# Altium schematic sheet MPCIE.SchDoc
size A3; SheetNumber: 10; SheetTotal: 22
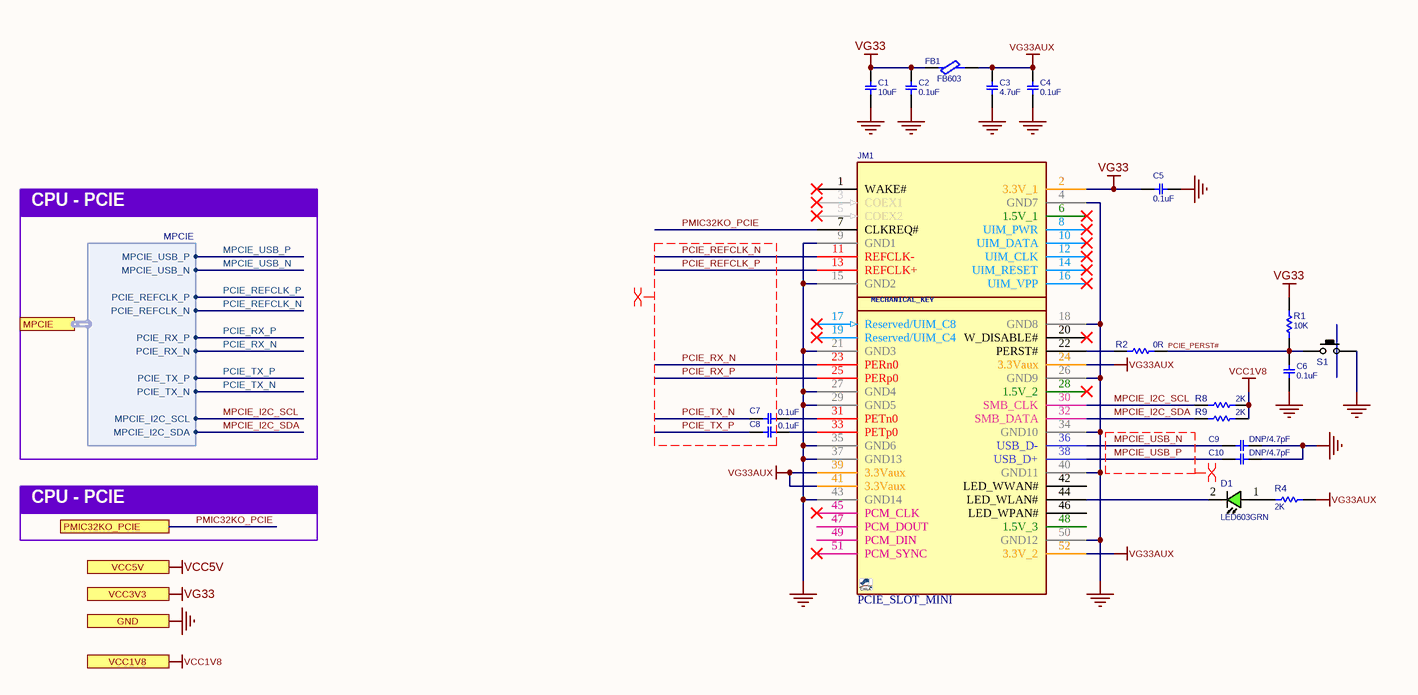
[diagram p0: MPCIE.SchDoc]

## Parts
C1  10uF  [C0402]
C2  0.1uF  [C0402]
C3  4.7uF  [C0402]
C4  0.1uF  [C0402]
C5  0.1uF  [C0402]
C6  0.1uF  [C0402]
C7  0.1uF  [C0402]
C8  0.1uF  [C0402]
C9  DNP/4.7pF  [C0402]
C10  DNP/4.7pF  [C0402]
D1  LED603GRN  [LED0603GRN]
FB1  FB603  [L0603]
JM1  PCIE_SLOT_MINI  [PCIE_MIN_CARD_FULL]
R1  10K  [R0402]
R2  0R  [R0402]
R4  2K  [R0402]
R8  2K  [R0402]
R9  2K  [R0402]
S1  PUSHBUTTON  [SWPBS_SPST_3X2X1]  (value not drawn)

## Ports
GND, MPCIE (harness MPCIE), PMIC32KO_PCIE, VCC1V8, VCC3V3, VCC5V

## Harnesses
MPCIE: PCIE_REFCLK_P, PCIE_REFCLK_N, MPCIE_USB_P, MPCIE_USB_N, PCIE_RX_P, PCIE_RX_N, PCIE_TX_P, PCIE_TX_N, MPCIE_I2C_SCL, MPCIE_I2C_SDA

## Nets
GND: C1.2 C2.2 C3.1 C4.2 C5.2 C6.1 C9.1 C10.1 JM1.4(GND7) JM1.9(GND1) JM1.15(GND2) JM1.18(GND8) JM1.21(GND3) JM1.26(GND9) JM1.27(GND4) JM1.29(GND5) JM1.34(GND10) JM1.35(GND6) JM1.37(GND13) JM1.40(GND11) JM1.43(GND14) JM1.50(GND12) S1.2(P3) ; port GND
VCC1V8: R8.2 R9.2 ; port VCC1V8
VCC5V: port VCC5V
VG33: C1.1 C2.1 C5.1 FB1.1 JM1.2(3.3V_1) R1.1 ; port VCC3V3
VG33AUX: C3.2 C4.1 FB1.2 JM1.24(3.3Vaux) JM1.39(3.3Vaux) JM1.41(3.3Vaux) JM1.52(3.3V_2) R4.2
MPCIE_I2C_SCL: JM1.30(SMB_CLK) R8.1 ; port MPCIE.MPCIE_I2C_SCL
MPCIE_I2C_SDA: JM1.32(SMB_DATA) R9.1 ; port MPCIE.MPCIE_I2C_SDA
MPCIE_USB_N: C9.2 JM1.36(USB_D-) ; port MPCIE.MPCIE_USB_N
MPCIE_USB_P: C10.2 JM1.38(USB_D+) ; port MPCIE.MPCIE_USB_P
PCIE_PERST#: C6.2 R1.2 R2.2 S1.1(P1)
PCIE_REFCLK_N: JM1.11(REFCLK-) ; port MPCIE.PCIE_REFCLK_N
PCIE_REFCLK_P: JM1.13(REFCLK+) ; port MPCIE.PCIE_REFCLK_P
PCIE_RX_N: JM1.23(PERn0) ; port MPCIE.PCIE_RX_N
PCIE_RX_P: JM1.25(PERp0) ; port MPCIE.PCIE_RX_P
PCIE_TX_N: C7.2 ; port MPCIE.PCIE_TX_N
PCIE_TX_P: C8.2 ; port MPCIE.PCIE_TX_P
PMIC32KO_PCIE: JM1.7(CLKREQ#) ; port PMIC32KO_PCIE
NetC7_1: C7.1 JM1.31(PETn0)
NetC8_1: C8.1 JM1.33(PETp0)
NetD1_1: D1.1(ANODE) R4.1
NetD1_2: D1.2(CATHODE) JM1.44(LED_WLAN#)
NetJM1_22: JM1.22(PERST#) R2.1

Not connected (* = marked no-connect by the designer): JM1 1(WAKE#)* 3(COEX1)* 5(COEX2)* 6(1.5V_1)* 8(UIM_PWR)* 10(UIM_DATA)* 12(UIM_CLK)* 14(UIM_RESET)* 16(UIM_VPP)* 17(Reserved/UIM_C8)* 19(Reserved/UIM_C4)* 20(W_DISABLE#)* 28(1.5V_2)* 42(LED_WWAN#) 45(PCM_CLK)* 46(LED_WPAN#) 47(PCM_DOUT) 48(1.5V_3) 49(PCM_DIN) 51(PCM_SYNC)*

## Layout directives
differential pair: MPCIE_USB_N, MPCIE_USB_P, PCIE_REFCLK_N, PCIE_REFCLK_P, PCIE_RX_N, PCIE_RX_P, PCIE_TX_N, PCIE_TX_P

## Notes on the sheet
- CPU - PCIE
- (in symbol PCIE_SLOT_MINI) MECHANICAL_KEY

## Library data of the parts
C1 = CAP_SMD_MLCC: CAP, MLCC; PARAM: X5R, 20%; MANF_P#: CL05A106MP5NUNC; MANF: Samsung; PARAM2: 10v; PRICE: 10,000: $0.034; ASSEMBLY: ASSEMBLY; VALUE: 10uF
C2 C4-C8 = CAP_SMD_MLCC_100n50TDK: CAP, MLCC; PARAM: X5R, 10%; MANF_P#: GRM155R61E104; MANF: Murata; PARAM2: 25v; ASSEMBLY: ASSEMBLY; PRICE: 10,000:$0.006; VALUE: 0.1uF
C3 = CAP_SMD_MLCC: CAP, MLCC; PARAM: X5R, 20%; MANF_P#: CL05A475MP5NRNC; MANF: Samsung; PARAM2: 10v; PRICE: 10,000: $0.034; ASSEMBLY: ASSEMBLY; VALUE: 4.7uF
C9 C10 = CAP_SMD_MLCC_100n50TDK: CAP, MLCC, 100nF, 50V, X7R, 10%, 0402C; PARAM: X7R, 10%, -55~125oC; MANF_P#: GCM155R71H104KE02D; MANF: Murata; PARAM2: 50V; ASSEMBLY: ASSEMBLY; PRICE: 100= 1.3$; VALUE: DNP/4.7pF
D1 = LED_SMD_0603_GRN_OSRAM: LED, SMD, 0603, GREEN; PARAM: 20mA; MANF: OSRAM; DESC: DESCRIPTION; MANF_P#: LG Q396-PS-35; PARAM2: 2.2V; ASSEMBLY: ASSEMBLY; PRICE: 0.36$; VALUE: LED603GRN
FB1 = FBEAD_SMD_BLM18KG601: FERRITE_Bead, 0603, 1.3A, 150mOhm, 600@100MHz; MANF: MURATA; MANF_P#: BLM18KG601SN1D; PARAM: 600@100MHz; PARAM2: 1.3A, 150mOhm; PRICE: 0.1$; VALUE: FB603
JM1 = PCIE_SLOT_MINI: CONN, PCIE SLOT, MINI, 2X26, SMT 0.8mm SP 1136H; MANF: Molex, JAE Electronics; MANF_P#: 679100002, MM60-52B1-E1-R650; PARAM2: PCI Express Mini Card 1mm thickness; PARAM: 0.80mm pitch, Right Angle, 2X26; PRICE: 1=2.16, 10=1.962, 25=1.842, 100=1.6817, 250=1.52152 (USD); VALUE: PCIE_SLOT_MINI
R1 R2 R4 R8 R9 = RES_SMD: RESISTOR, SMD; PARAM: 0.063W; DESC: DESCRIPTION; DIST#: MOUSER; PARAM2: 1%; MANF_P#: -; MANF: -; ASSEMBLY: ASSEMBLY; PRICE: 100= 0.3$
  R1: VALUE: 10K
  R2: VALUE: 0R
  R4 R8 R9: VALUE: 2K
S1 = SWPBS_SPST_3X2_B3U-1000P: SWITCH, PUSH BUTTON, TACTILE, SMD, SPST, 3X2.5X1.2mm; MANF: OMRON; DESC: DESCRIPTION; VALUE: PUSHBUTTON; ASSEMBLY: ASSEMBLY; PARAM: PARAM; PRICE: PRICE; MANF_P#: B3U-1000P